# Altium schematic sheet Output_Contactor.SchDoc
size A; SheetNumber: 6; SheetTotal: 8
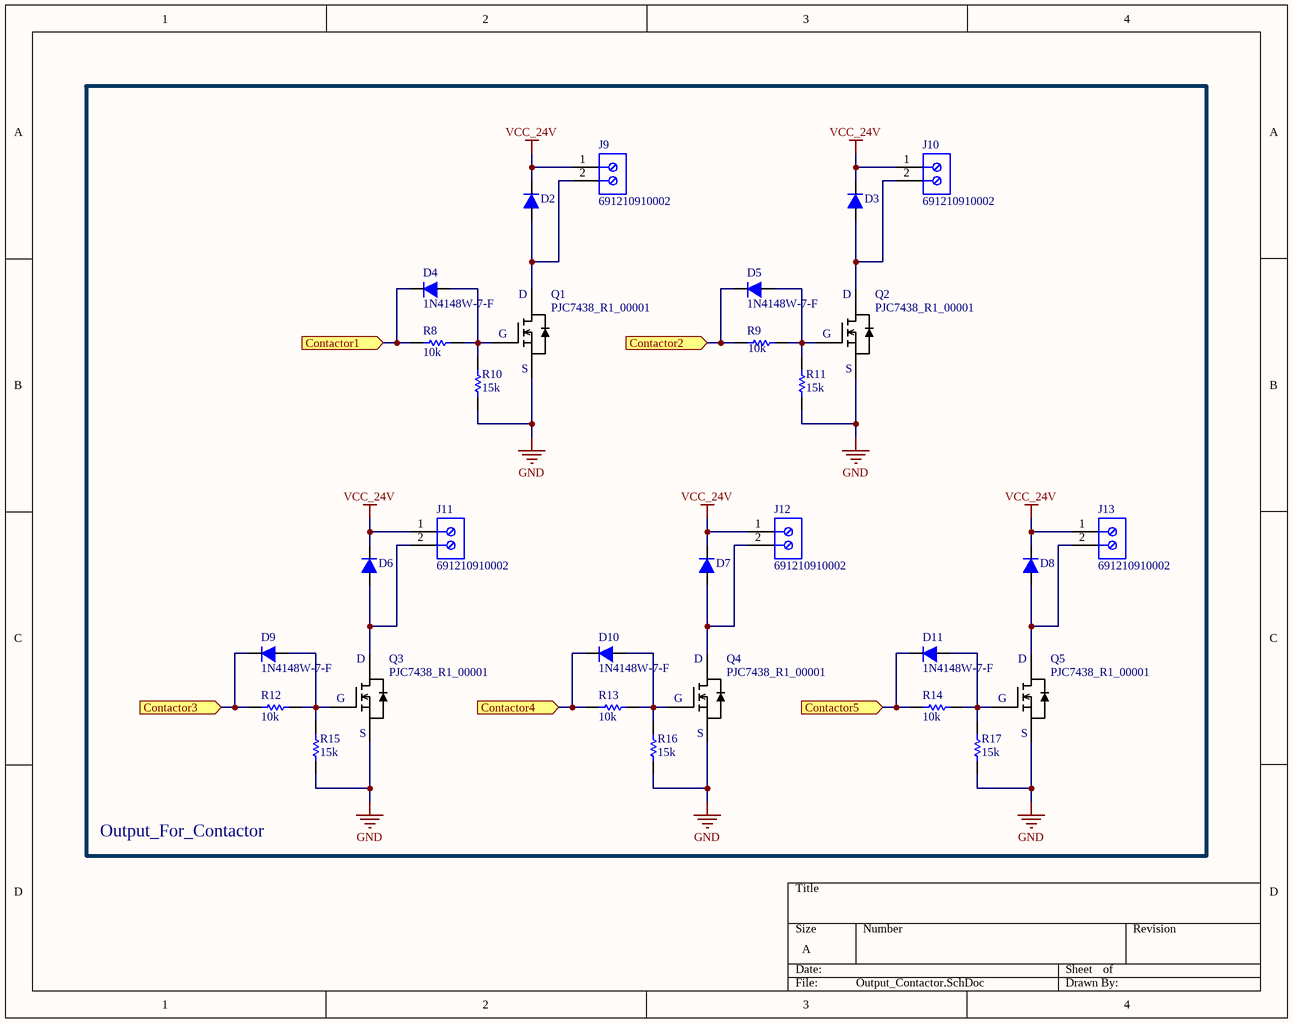
[diagram p0: Output_Contactor.SchDoc]

## Parts
D2  US1A-13-F  [US1A-13-F]  (value not drawn)
D3  US1A-13-F  [US1A-13-F]  (value not drawn)
D4  1N4148W-7-F  [1N4148]
D5  1N4148W-7-F  [1N4148]
D6  US1A-13-F  [US1A-13-F]  (value not drawn)
D7  US1A-13-F  [US1A-13-F]  (value not drawn)
D8  US1A-13-F  [US1A-13-F]  (value not drawn)
D9  1N4148W-7-F  [1N4148]
D10  1N4148W-7-F  [1N4148]
D11  1N4148W-7-F  [1N4148]
J9  691210910002  [691210910002]
J10  691210910002  [691210910002]
J11  691210910002  [691210910002]
J12  691210910002  [691210910002]
J13  691210910002  [691210910002]
Q1  PJC7438_R1_00001  [PJC7438]
Q2  PJC7438_R1_00001  [PJC7438]
Q3  PJC7438_R1_00001  [PJC7438]
Q4  PJC7438_R1_00001  [PJC7438]
Q5  PJC7438_R1_00001  [PJC7438]
R8  value 10k  [RES-SM-0603]  (hidden comment: ESR03EZPF1002)
R9  value 10k  [RES-SM-0603]  (hidden comment: ESR03EZPF1002)
R10  value 15k  [RES-SM-0603]  (hidden comment: ESR03EZPJ153)
R11  value 15k  [RES-SM-0603]  (hidden comment: ESR03EZPJ153)
R12  value 10k  [RES-SM-0603]  (hidden comment: ESR03EZPF1002)
R13  value 10k  [RES-SM-0603]  (hidden comment: ESR03EZPF1002)
R14  value 10k  [RES-SM-0603]  (hidden comment: ESR03EZPF1002)
R15  value 15k  [RES-SM-0603]  (hidden comment: ESR03EZPJ153)
R16  value 15k  [RES-SM-0603]  (hidden comment: ESR03EZPJ153)
R17  value 15k  [RES-SM-0603]  (hidden comment: ESR03EZPJ153)

## Blocks framed on the sheet
Output_For_Contactor: D2-D11 J9-J13 Q1-Q5 R8-R17

## Ports
Contactor1 (in), Contactor2 (in), Contactor3 (in), Contactor4 (in), Contactor5 (in)

## Nets
GND: Q1.2(S) Q2.2(S) Q3.2(S) Q4.2(S) Q5.2(S) R10.2 R11.2 R15.2 R16.2 R17.2
VCC_24V: D2.2(K) D3.2(K) D6.2(K) D7.2(K) D8.2(K) J9.1 J10.1 J11.1 J12.1 J13.1
Contactor1: D4.2(K) R8.2 ; port Contactor1
Contactor2: D5.2(K) R9.2 ; port Contactor2
Contactor3: D9.2(K) R12.2 ; port Contactor3
Contactor4: D10.2(K) R13.2 ; port Contactor4
Contactor5: D11.2(K) R14.2 ; port Contactor5
NetD2_1: D2.1(A) J9.2 Q1.3(D)
NetD3_1: D3.1(A) J10.2 Q2.3(D)
NetD4_1: D4.1(A) Q1.1(G) R8.1 R10.1
NetD5_1: D5.1(A) Q2.1(G) R9.1 R11.1
NetD6_1: D6.1(A) J11.2 Q3.3(D)
NetD7_1: D7.1(A) J12.2 Q4.3(D)
NetD8_1: D8.1(A) J13.2 Q5.3(D)
NetD9_1: D9.1(A) Q3.1(G) R12.1 R15.1
NetD10_1: D10.1(A) Q4.1(G) R13.1 R16.1
NetD11_1: D11.1(A) Q5.1(G) R14.1 R17.1

## Library data of the parts
D2 D3 D6-D8 = US1A-13-F: Diode Standard 50 V 1A Surface Mount SMA; Mfr: Diodes Incorporated; Voltage - DC Reverse (Vr) (Max): 50 V; Voltage - Forward (Vf) (Max) @ If: 1 V @ 1 A; Speed: Fast Recovery =< 500ns, > 200mA (Io); Reverse Recovery Time (trr): 50 ns; Current - Reverse Leakage @ Vr: 5 µA @ 50 V; Capacitance @ Vr, F: 20pF @ 4V, 1MHz; Base Product Number: US1A; No. Pad (SMD): 2; No. Pad (THT): 0; Diode Type: Standard; Current - Average Rectified (Io): 1A; Mounting Type: Surface Mount; Package / Case: DO-214AC, SMA; Supplier Device Package: SMA; Operating Temperature - Junction: -65°C ~ 150°C; Unit Price (Digikey): 0.46
  D3: ComponentLink1Description: New link; ComponentLink1URL: *
D4 D5 D9-D11 = 1N4148: Diode Standard 100 V 300mA (DC) Surface Mount SOD-123; Mfr: Diodes Incorporated; Voltage - DC Reverse (Vr) (Max): 100 V; Voltage - Forward (Vf) (Max) @ If: 1.25 V @ 150 mA; Speed: Small Signal =< 200mA (Io), Any Speed; Reverse Recovery Time (trr): 4 ns; Current - Reverse Leakage @ Vr: 1 µA @ 100 V; Capacitance @ Vr, F: 2pF @ 0V, 1MHz; No. Pad (SMD): 2; No. Pad (THT): 0; ComponentLink1Description: New link; ComponentLink1URL: https://www.digikey.com/en/products/detail/diodes-incorporated/1N4148W-7-F/814371; Diode Type: Standard; Current - Average Rectified (Io): 300mA (DC); Mounting Type: Surface Mount; Unit Price (Digikey): 0.18
J9-J13 = 691210910002: WR-TBL Serie 2109 Horizontal Entry, Rising Cage Clamp, pitch 2.54mm, 2p; Compliance: Lead free / RoHS; Modularity: No; PCB/Cable/Panel: PCB; Pin Number: 2; Rated Current [UL]: 6A; Working Voltage [UL]: 150VAC; No. Pad (SMD): 0; ComponentLink1Description: Manufacturer; ComponentLink1URL: http://www.we-online.de; ComponentLink2URL: https://katalog.we-online.de/em/datasheet/691210910002.pdf; ComponentLink2Description: Datasheet; Mounting Technology: THT; Part Number: 691210910002; Packaging: Box; Operating Temperature: -40 to +105degC; Pitch: 2.54mm; Published Date: October 2019; Type: Horizontal; Publisher: Wurth Elektronik; Application: Rising Cage Clamp; No. Pad (THT): 2; Unit Price (Digikey): 1.14
Q1-Q5 = PJC7438: N-Channel 50 V 400mA (Ta) 350mW (Ta) Surface Mount SOT-323; Mfr: Panjit International Inc.; Drain to Source Voltage (Vdss): 50 V; Drive Voltage (Max Rds On, Min Rds On): 1.8V, 10V; Rds On (Max) @ Id, Vgs: 1.45Ohm @ 500mA, 10V; Vgs(th) (Max) @ Id: 1V @ 250µA; Gate Charge (Qg) (Max) @ Vgs: 0.95 nC @ 4.5 V; Vgs (Max): ±20V; Input Capacitance (Ciss) (Max) @ Vds: 36 pF @ 25 V; No. Pad (SMD): 3; No. Pad (THT): 0; ComponentLink1Description: New link; ComponentLink1URL: https://www.panjit.com.tw/upload/datasheet/PJC7438.pdf; FET Type: N-Channel; Technology: MOSFET (Metal Oxide); Current - Continuous Drain (Id) @ 25°C: 400mA (Ta); Power Dissipation (Max): 350mW (Ta); Operating Temperature: -55°C ~ 150°C (TJ); Mounting Type: Surface Mount; Package / Case: SC-70, SOT-323; Unit Price (Digikey): 0.47
R8 R9 R12-R14 = RESISTOR SMD: RES SMD 10K OHM 1% 1/4W 0603; Mfr: Rohm Semiconductor; Resistance: 10 kOhms; Power (Watts): 0.25W, 1/4W; Temperature Coefficient: ±100ppm/°C; No. Pad (SMD): 2; No. Pad (THT): 0; Series: ESR; Tolerance: ±1%; Composition: Thick Film; Features: Automotive AEC-Q200, Pulse Withstanding; Operating Temperature: -55°C ~ 155°C; Package / Case: 0603 (1608 Metric); Supplier Device Package: 0603; Ratings: AEC-Q200; Size / Dimension: 0.063" L x 0.031" W (1.60mm x 0.80mm); Height - Seated (Max): 0.022" (0.55mm); Number of Terminations: 2; Unit Price (Digikey): 0.15
R10 R11 R15-R17 = RESISTOR SMD: RES SMD 15K OHM 5% 1/4W 0603; Mfr: Rohm Semiconductor; Resistance: 15 kOhms; Power (Watts): 0.25W, 1/4W; Temperature Coefficient: ±200ppm/°C; No. Pad (SMD): 2; No. Pad (THT): 0; Series: ESR; Tolerance: ±5%; Composition: Thick Film; Features: Automotive AEC-Q200, Pulse Withstanding; Operating Temperature: -55°C ~ 155°C; Package / Case: 0603 (1608 Metric); Supplier Device Package: 0603; Ratings: AEC-Q200; Size / Dimension: 0.063" L x 0.031" W (1.60mm x 0.80mm); Height - Seated (Max): 0.022" (0.55mm); Number of Terminations: 2; Unit Price (Digikey): 0.14